# Altium schematic sheet Subtractor.SchDoc
size A; SheetNumber: 1; SheetTotal: 1; SPICEModelCachePXSGLYPY: <root> / <DocumentId>PXSGLYPY</DocumentId> / </root>
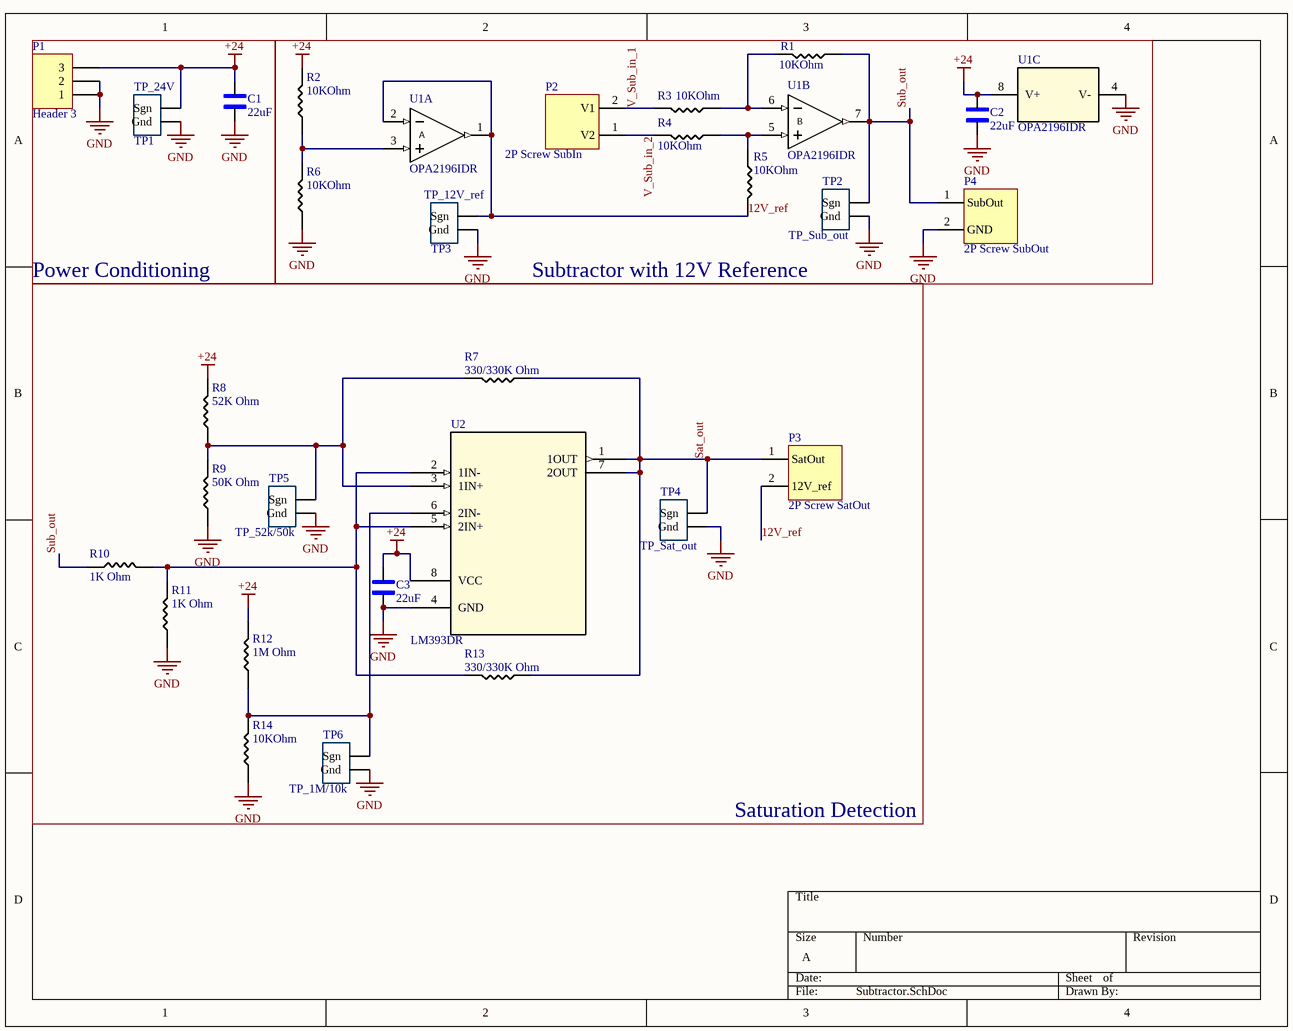
[diagram p0: Subtractor.SchDoc]

## Parts
C1  22uF  [1206_Passive_Capacitor]
C2  22uF  [1206_Passive_Capacitor]
C3  22uF  [1206_Passive_Capacitor]
P1  Header 3  [HDR1X3]
P2  2P Screw SubIn  [P_Terminal block 3.5mm-pitch]
P3  2P Screw SatOut  [P_Terminal block 3.5mm-pitch]
P4  2P Screw SubOut  [P_Terminal block 3.5mm-pitch]
R1  value 10KOhm  [1206_Passive_Resitor]  (hidden comment: 10k)
R2  value 10KOhm  [1206_Passive_Resitor]  (hidden comment: 10k)
R3  value 10KOhm  [1206_Passive_Resitor]  (hidden comment: 10k)
R4  value 10KOhm  [1206_Passive_Resitor]  (hidden comment: 10k)
R5  value 10KOhm  [1206_Passive_Resitor]  (hidden comment: 10k)
R6  value 10KOhm  [1206_Passive_Resitor]  (hidden comment: 10k)
R7  value 330/330K Ohm  [1206_Passive_Resitor]  (hidden comment: 1k)
R8  value 52K Ohm  [1206_Passive_Resitor]  (hidden comment: 1k)
R9  value 50K Ohm  [1206_Passive_Resitor]  (hidden comment: 1k)
R10  value 1K Ohm  [1206_Passive_Resitor]  (hidden comment: 1k)
R11  value 1K Ohm  [1206_Passive_Resitor]  (hidden comment: 1k)
R12  value 1M Ohm  [1206_Passive_Resitor]  (hidden comment: 1M)
R13  value 330/330K Ohm  [1206_Passive_Resitor]  (hidden comment: 1k)
R14  value 10KOhm  [1206_Passive_Resitor]  (hidden comment: 10k)
TP1  TP_24V  [TP10x_Probe]
TP2  TP_Sub_out  [TP10x_Probe]
TP3  TP_12V_ref  [TP10x_Probe]
TP4  TP_Sat_out  [TP10x_Probe]
TP5  TP_52k/50k  [TP10x_Probe]
TP6  TP_1M/10k  [TP10x_Probe]
U1  OPA2196IDR  [D0008A_N]  (parts A,B,C of 3)
U2  LM393DR  [D8]

## Blocks framed on the sheet
Power Conditioning: C1 P1 TP1
Subtractor with 12V Reference: C2 P2 P4 R1-R6 TP2 TP3 U1
Saturation Detection: C3 P3 R7-R14 TP4-TP6 U2

## Nets
+24: C1.2 C2.2 C3.2 P1.3 R2.2 R8.2 R12.2 TP1.1(Sgn) U1.8(V+) U2.8(VCC)
GND: C1.1 C2.1 C3.1 P1.1 P1.2 P4.2(GND) R6.1 R9.1 R11.1 R14.1 TP1.2(Gnd) TP2.2(Gnd) TP3.2(Gnd) TP4.2(Gnd) TP5.2(Gnd) TP6.2(Gnd) U1.4(V-) U2.4(GND)
12V_ref: P3.2(12V_ref) R5.2 TP3.1(Sgn) U1.1(OUT) U1.2(IN-)
Sat_out: P3.1(SatOut) R7.1 R13.1 TP4.1(Sgn) U2.1(1OUT) U2.7(2OUT)
Sub_out: P4.1(SubOut) R1.1 R10.1 TP2.1(Sgn) U1.7(OUT)
V_Sub_in_1: P2.2(V1) R3.2
V_Sub_in_2: P2.1(V2) R4.2
NetR1_2: R1.2 R3.1 U1.6(IN-)
NetR2_1: R2.1 R6.2 U1.3(IN+)
NetR4_1: R4.1 R5.1 U1.5(IN+)
NetR7_2: R7.2 R8.1 R9.2 TP5.1(Sgn) U2.3(1IN+)
NetR10_2: R10.2 R11.2 R13.2 U2.2(1IN-) U2.5(2IN+)
NetR12_1: R12.1 R14.2 TP6.1(Sgn) U2.6(2IN-)

## Notes on the sheet
- (in symbol OPA2196IDR, part A) A
- (in symbol OPA2196IDR, part B) B

## Library data of the parts
C1-C3 = C_22uF_1206: 22uF ±10% 25V X5R 1206 Multilayer Ceramic Capacitors MLCC - SMD/SMT RoHS; MFR Part #: CL31A226KAHNNNE; Type: basic; LCSC Part#: C12891; Datasheet: https://datasheet.lcsc.com/lcsc/1811031514_Samsung-Electro-Mechanics-CL31A226KAHNNNE_C12891.pdf; Value: 22uF
P1 = Header 3: Header, 3-Pin; LatestRevisionDate: 17-Jul-2002; LatestRevisionNote: Re-released for DXP Platform.; Publisher: Altium Limited
P2-P4 = P_Terminal block: Green Straight pin 3.5mm  pitch; P=3.5mm  Screw terminal ROHS; MFR Part #: KF350-3.5-2P; Manufacturer: Cixi Kefa Elec; LCSC Part#: C474892; DataSheet: https://datasheet.lcsc.com/lcsc/2001160007_Cixi-Kefa-Elec-KF350-3-5-2P_C474892.pdf
R1-R6 R14 = R_10KOhm_1206: 10 kOhms ±5% 0.25W, 1/4W Chip Resistor 1206 (3216 Metric) Automotive AEC-Q200 Thick Film; MFR Part #: RMCF1206FT10K0; Digikey Link: https://www.digikey.com/en/products/detail/stackpole-electronics-inc/RMCF1206FT10K0/1759669; LCSC Part#: C17902; Type: Basic
R7-R11 R13 = R_1K_1206: CHIP RESISTOR - SURFACE MOUNT 1KOHMS ±1% 1/4W 1206 ROHS; MFR Part #: RNCP1206FTD1K00CT; Digikey Link: https://www.digikey.com/product-detail/en/RNCP1206FTD1K00/RNCP1206FTD1K00CT-ND/2240675/?itemSeq=304982373; LCSC Part#: C4410; Type: Basic
R12 = R_1M_1206: CHIP RESISTOR - SURFACE MOUNT 1MOHMS ±1% 1/4W 1206 ROHS; MFR Part #: RMCF1206JT1M00; Digikey Link: https://www.digikey.com/product-detail/en/RMCF1206JT1M00/RMCF1206JT1M00CT-ND/1942830/?itemSeq=304982358; LCSC Part#: C17927; Type: Basic
TP1-TP6 = TP_10x_Probe: Test Point 300 mil centers
U1 = OPA2196IDR: Dual, 36-V, low power, all-purpose amplifier with mux-friendly input 8-SOIC -40 to 125; Manufacturer_Name: Texas Instruments; TYPE: TYPE; RefDes: RefDes; Copyright: Copyright (C) 2026 Ultra Librarian. All rights reserved.; Manufacturer_Part_Number: OPA2196IDR; Datasheet: https://www.ti.com/lit/gpn/opa2196
U2 = LM393DR: Dual differential comparator, commercial grade 8-SOIC 0 to 70; Manufacturer_Name: Texas Instruments; Copyright: Copyright (C) 2025 Ultra Librarian. All rights reserved.; Manufacturer_Part_Number: LM393DR; RefDes: RefDes; Type: Type